# Altium schematic sheet Connector.SchDoc
size A4; SheetNumber: 4; SheetTotal: 4
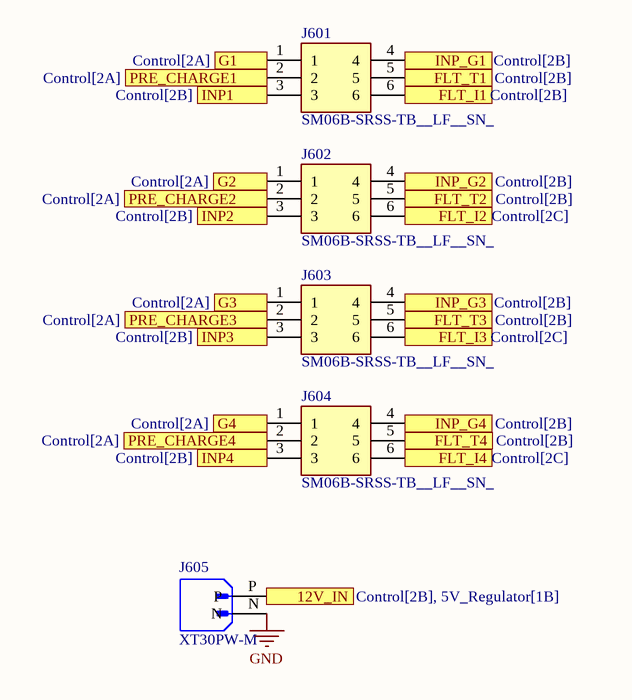
[diagram p0: Connector.SchDoc]

## Parts
J601  SM06B-SRSS-TB__LF__SN_  [SM06B-SRSS-TB]
J602  SM06B-SRSS-TB__LF__SN_  [SM06B-SRSS-TB]
J603  SM06B-SRSS-TB__LF__SN_  [SM06B-SRSS-TB]
J604  SM06B-SRSS-TB__LF__SN_  [SM06B-SRSS-TB]
J605  XT30PW-M  [AMASS_XT30PW-M]

## Ports
12V_IN (out, see Control[2B], 5V_Regulator[1B]), FLT_I1 (out, see Control[2B]), FLT_I2 (out, see Control[2C]), FLT_I3 (out, see Control[2C]), FLT_I4 (out, see Control[2C]), FLT_T1 (out, see Control[2B]), FLT_T2 (out, see Control[2B]), FLT_T3 (out, see Control[2B]), FLT_T4 (out, see Control[2B]), G1 (in, see Control[2A]), G2 (in, see Control[2A]), G3 (in, see Control[2A]), G4 (in, see Control[2A]), INP1 (in, see Control[2B]), INP2 (in, see Control[2B]), INP3 (in, see Control[2B]), INP4 (in, see Control[2B]), INP_G1 (in, see Control[2B]), INP_G2 (in, see Control[2B]), INP_G3 (in, see Control[2B]), INP_G4 (in, see Control[2B]), PRE_CHARGE1 (in, see Control[2A]), PRE_CHARGE2 (in, see Control[2A]), PRE_CHARGE3 (in, see Control[2A]), PRE_CHARGE4 (in, see Control[2A])

## Nets
GND: J605.N
12V_IN: J605.P ; port 12V_IN
FLT_I1: J601.6 ; port FLT_I1
FLT_I2: J602.6 ; port FLT_I2
FLT_I3: J603.6 ; port FLT_I3
FLT_I4: J604.6 ; port FLT_I4
FLT_T1: J601.5 ; port FLT_T1
FLT_T2: J602.5 ; port FLT_T2
FLT_T3: J603.5 ; port FLT_T3
FLT_T4: J604.5 ; port FLT_T4
G1: J601.1 ; port G1
G2: J602.1 ; port G2
G3: J603.1 ; port G3
G4: J604.1 ; port G4
INP1: J601.3 ; port INP1
INP2: J602.3 ; port INP2
INP3: J603.3 ; port INP3
INP4: J604.3 ; port INP4
INP_G1: J601.4 ; port INP_G1
INP_G2: J602.4 ; port INP_G2
INP_G3: J603.4 ; port INP_G3
INP_G4: J604.4 ; port INP_G4
PRE_CHARGE1: J601.2 ; port PRE_CHARGE1
PRE_CHARGE2: J602.2 ; port PRE_CHARGE2
PRE_CHARGE3: J603.2 ; port PRE_CHARGE3
PRE_CHARGE4: J604.2 ; port PRE_CHARGE4

## Library data of the parts
J601-J604 = SM06B-SRSS-TB__LF__SN_: Connector; Manufacturer_Name: JST (JAPAN SOLDERLESS TERMINALS); Manufacturer_Part_Number: SM06B-SRSS-TB (LF)(SN); Datasheet Link: http://uk.rs-online.com/web/p/products/5468827
J605 = CMP-019-000079-2: Socket; DC supply; XT30; male; PIN: 2; on PCBs; THT; Colour: yellow; System: Connector; MF: AMASS; Check_prices: https://www.snapeda.com/parts/XT30PW-M/AMASS/view-part/?ref=eda; Source: XT30PW-M.SchLib; Pin Count: 2; Value: *; Package: None; Component Type: Standard; SnapEDA_Link: https://www.snapeda.com/parts/XT30PW-M/AMASS/view-part/?ref=snap; MP: XT30PW-M; Design Item ID: XT30PW-M